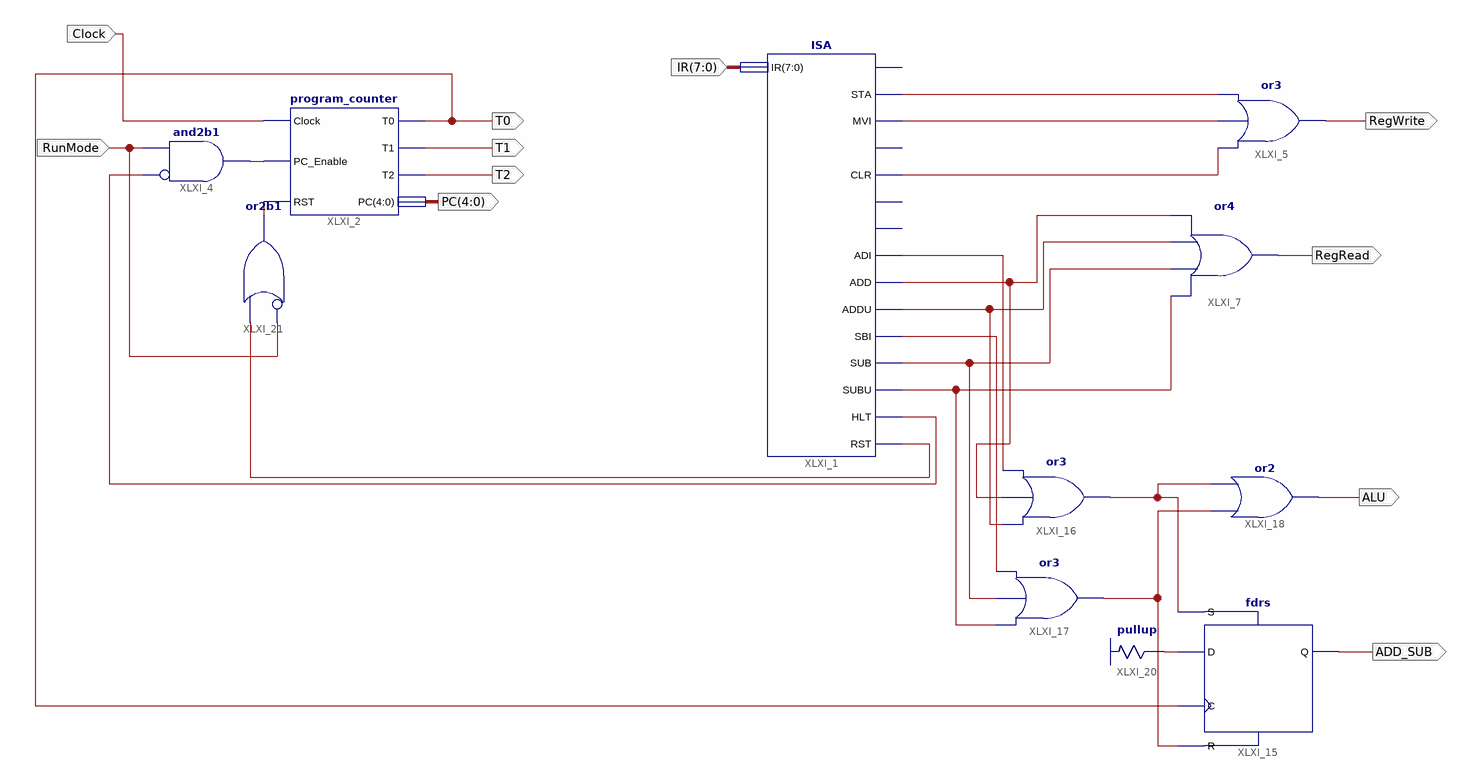
[diagram p0: schematic sheet 1]
// Xilinx ISE schematic Control.sch (spartan3e) as structural Verilog: 11 symbols, 11 ports
module Control (
  input  Clock,
  input  RunMode,
  input  [7:0] IR,
  output [4:0] PC,
  output RegWrite,
  output RegRead,
  output ALU,
  output ADD_SUB,
  output T2,
  output T1,
  output T0
);

  wire XLXN_5, XLXN_7, XLXN_16, XLXN_17, XLXN_19, XLXN_45, XLXN_46, XLXN_47, XLXN_48, XLXN_49, XLXN_50,
       XLXN_51, XLXN_52, XLXN_57, XLXN_61, XLXN_62;

  ISA XLXI_1 (
    .IR(IR), .STA(XLXN_16), .MVI(XLXN_17), .CLR(XLXN_19), .ADI(XLXN_47), .ADD(XLXN_48), .ADDU(XLXN_49),
    .SBI(XLXN_50), .SUB(XLXN_51), .SUBU(XLXN_52), .HLT(XLXN_7), .RST(XLXN_62));  // open: LDA, LCA, SET, GET
  program_counter XLXI_2 (.Clock(Clock), .PC_Enable(XLXN_5), .RST(XLXN_61), .T0(T0), .T1(T1), .T2(T2), .PC(PC));
  and XLXI_4 (XLXN_5, ~XLXN_7, RunMode);  // and2b1
  or XLXI_5 (RegWrite, XLXN_19, XLXN_17, XLXN_16);
  or XLXI_7 (RegRead, XLXN_52, XLXN_51, XLXN_49, XLXN_48);
  fdrs XLXI_15 (.C(T0), .D(XLXN_57), .R(XLXN_46), .S(XLXN_45), .Q(ADD_SUB));
  or XLXI_16 (XLXN_45, XLXN_49, XLXN_48, XLXN_47);
  or XLXI_17 (XLXN_46, XLXN_52, XLXN_51, XLXN_50);
  or XLXI_18 (ALU, XLXN_46, XLXN_45);
  \pullup  XLXI_20 (.O(XLXN_57));
  or XLXI_21 (XLXN_61, ~RunMode, XLXN_62);  // or2b1
endmodule
